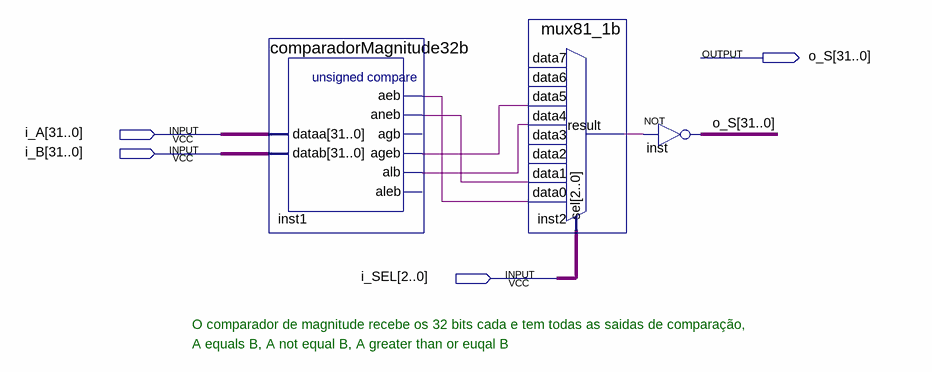
[diagram p0: schematic sheet]
// Quartus schematic Branch_Control.bdf as structural Verilog: 3 symbols, 4 pins
module Branch_Control (
  input  [31:0] i_A,
  input  [31:0] i_B,
  input  [2:0] i_SEL,
  output [31:0] o_S
);

  wire inst1_aeb, inst1_ageb, inst1_alb, inst1_aneb, inst2_result;

  comparadorMagnitude32b inst1 (
    .dataa(i_A), .datab(i_B), .aeb(inst1_aeb), .aneb(inst1_aneb), .ageb(inst1_ageb), .alb(inst1_alb));  // open: agb, aleb
  mux81_1b inst2 (
    .data5(inst1_ageb), .data4(inst1_alb), .data1(inst1_aneb), .data0(inst1_aeb), .sel(i_SEL),
    .result(inst2_result));  // open: data7, data6, data3, data2
  assign o_S = ~{32{inst2_result}};  // NOT inst, 32 bits wide

  // Notes on the sheet:
  //   O comparador de magnitude recebe os 32 bits cada e tem todas as saidas de comparação,
  //   A equals B, A not equal B, A greater than or euqal B
endmodule
